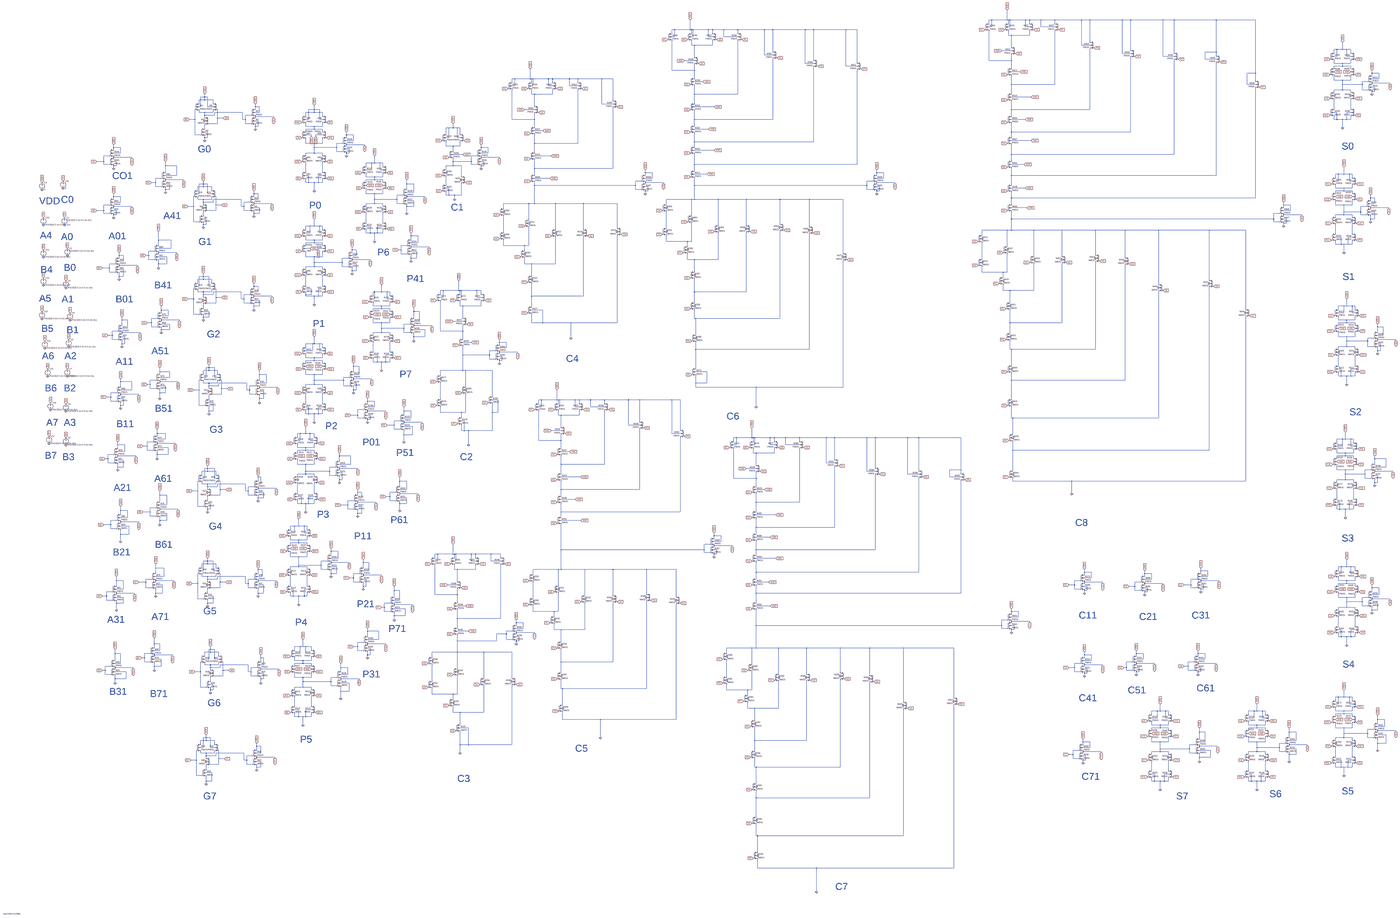
[diagram p0: schematic 8_BIT.asc, whole sheet]
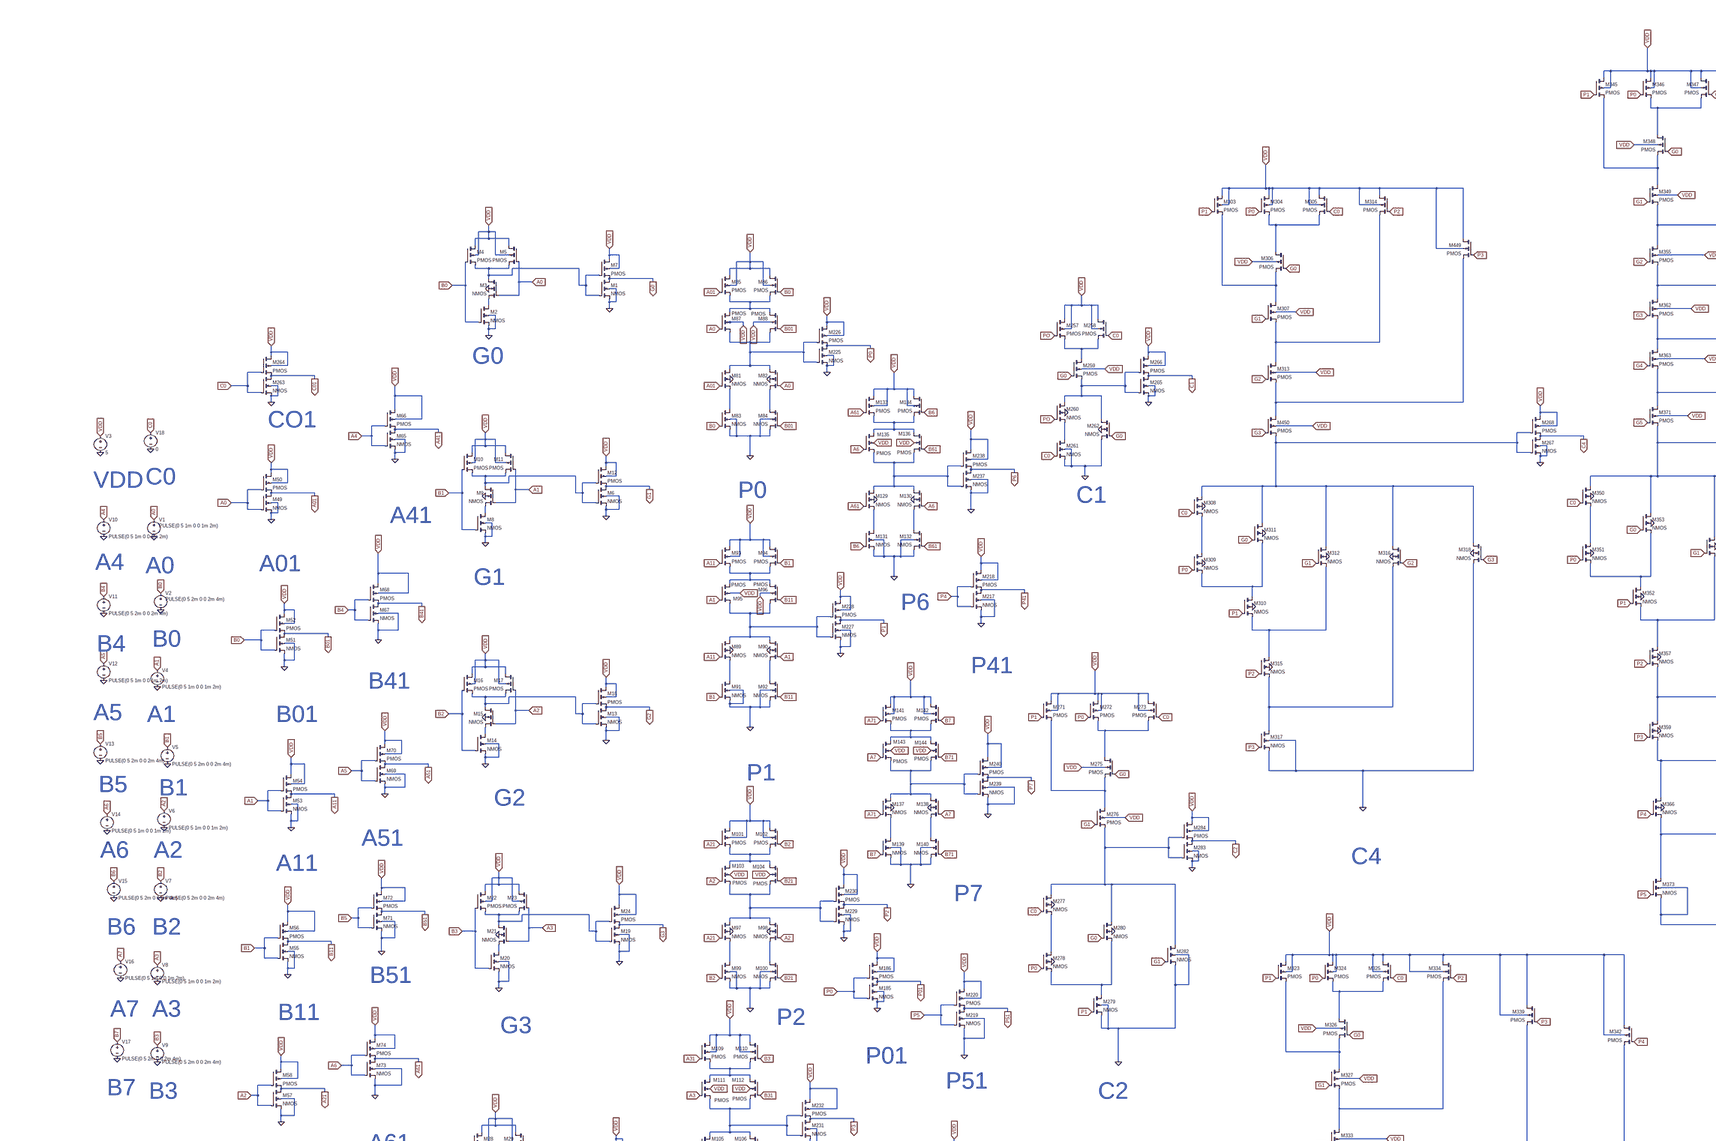
[diagram p1: schematic 8_BIT.asc, part, row 1 of 2, column 1 of 2]
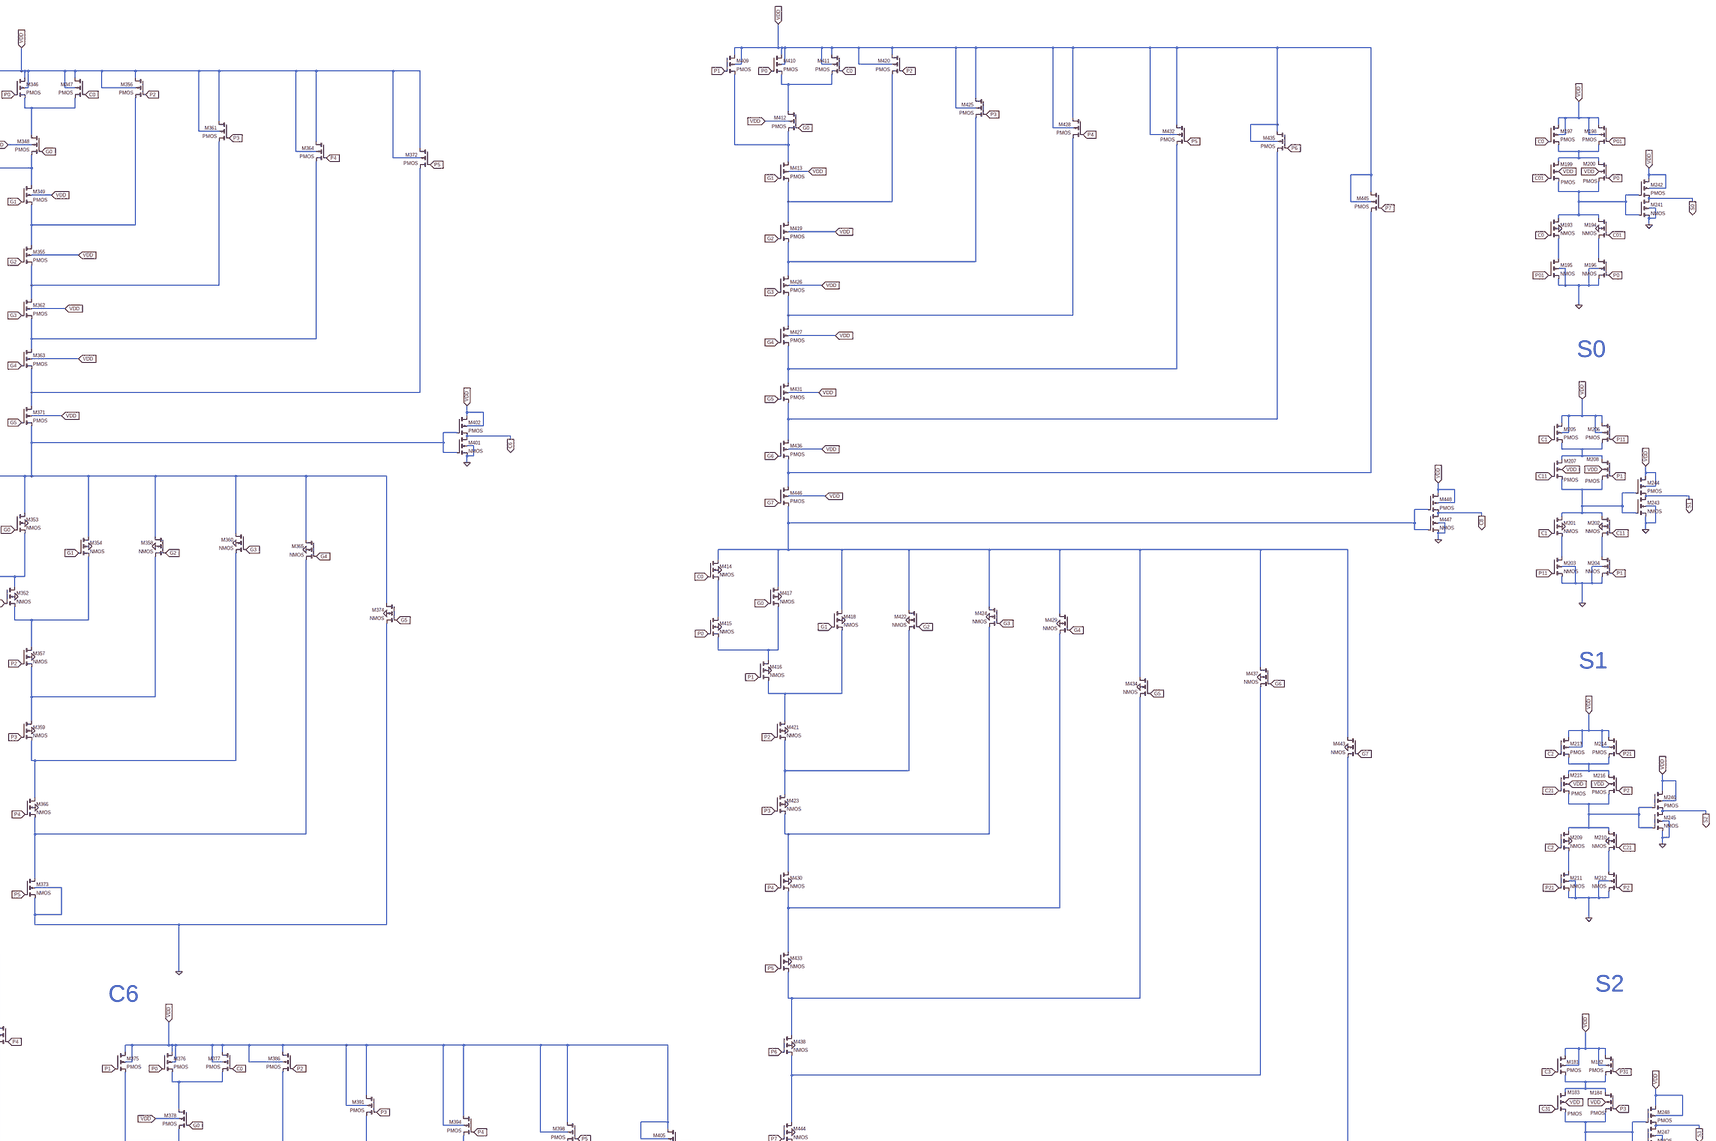
[diagram p2: schematic 8_BIT.asc, part, row 1 of 2, column 2 of 2]
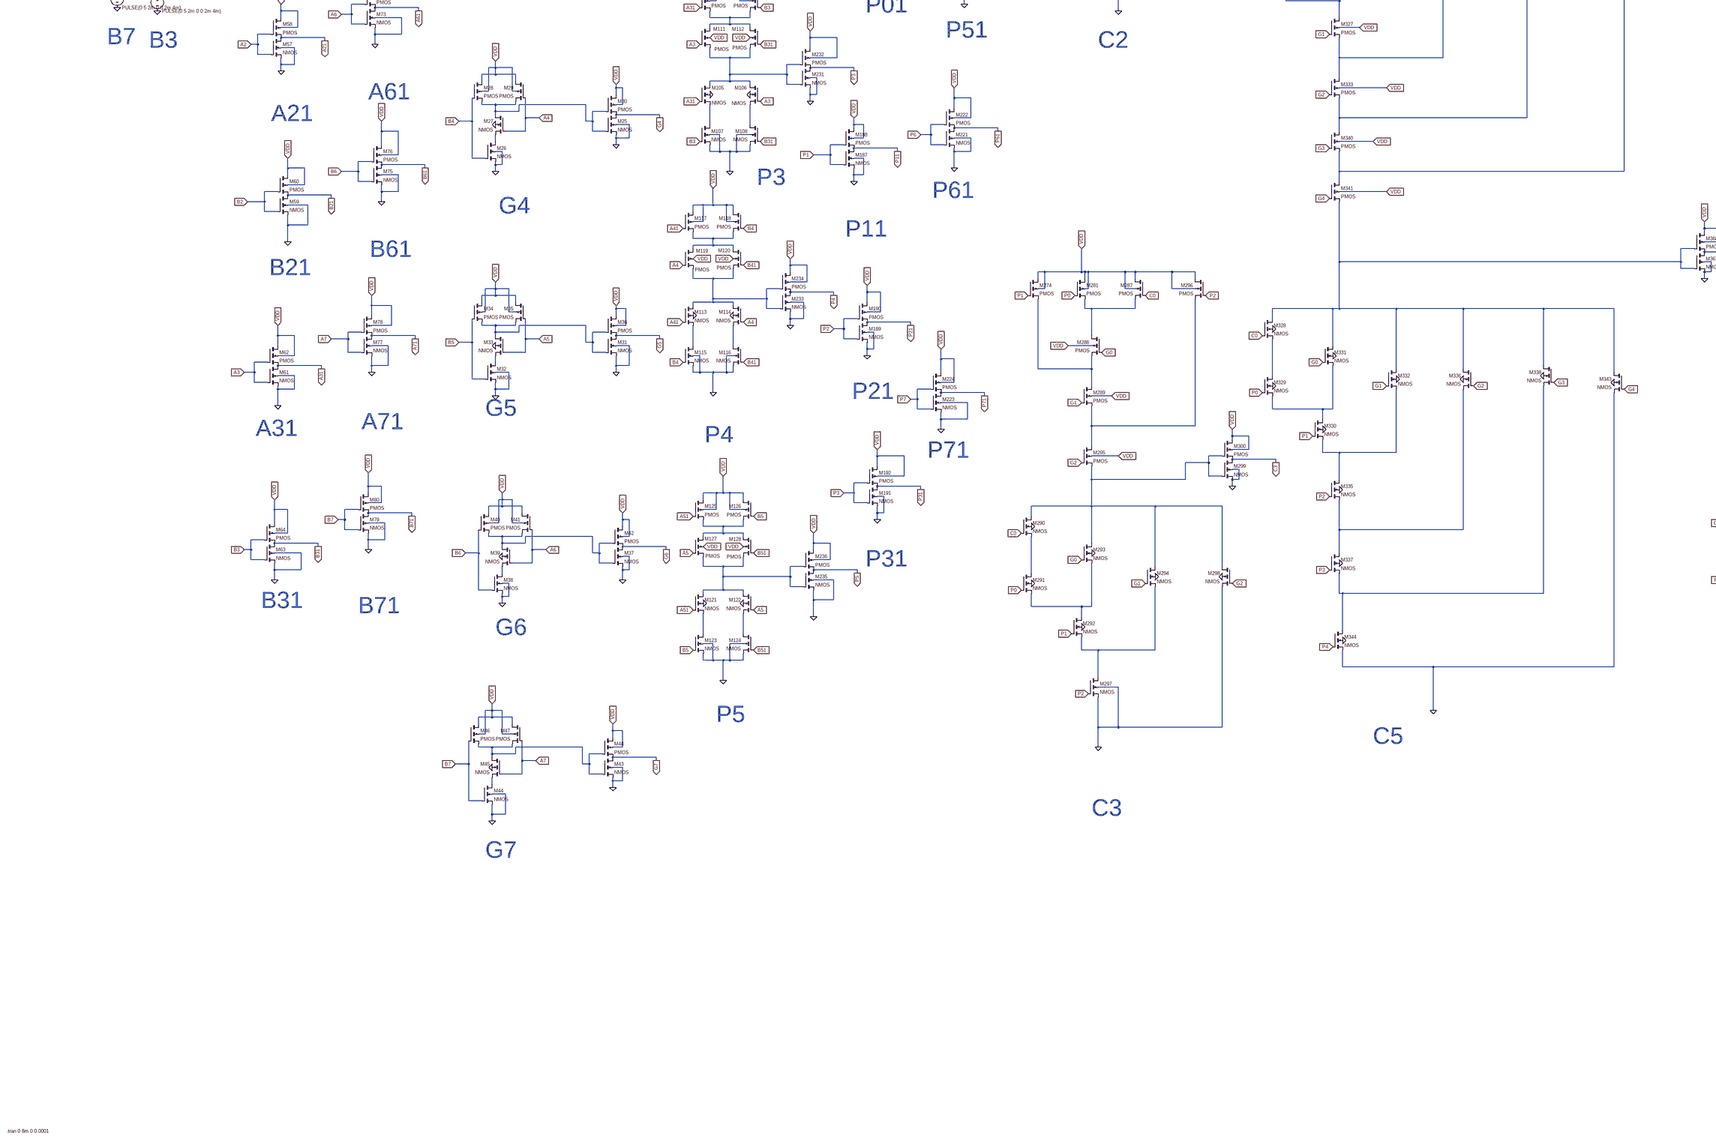
[diagram p3: schematic 8_BIT.asc, part, row 2 of 2, column 1 of 2]
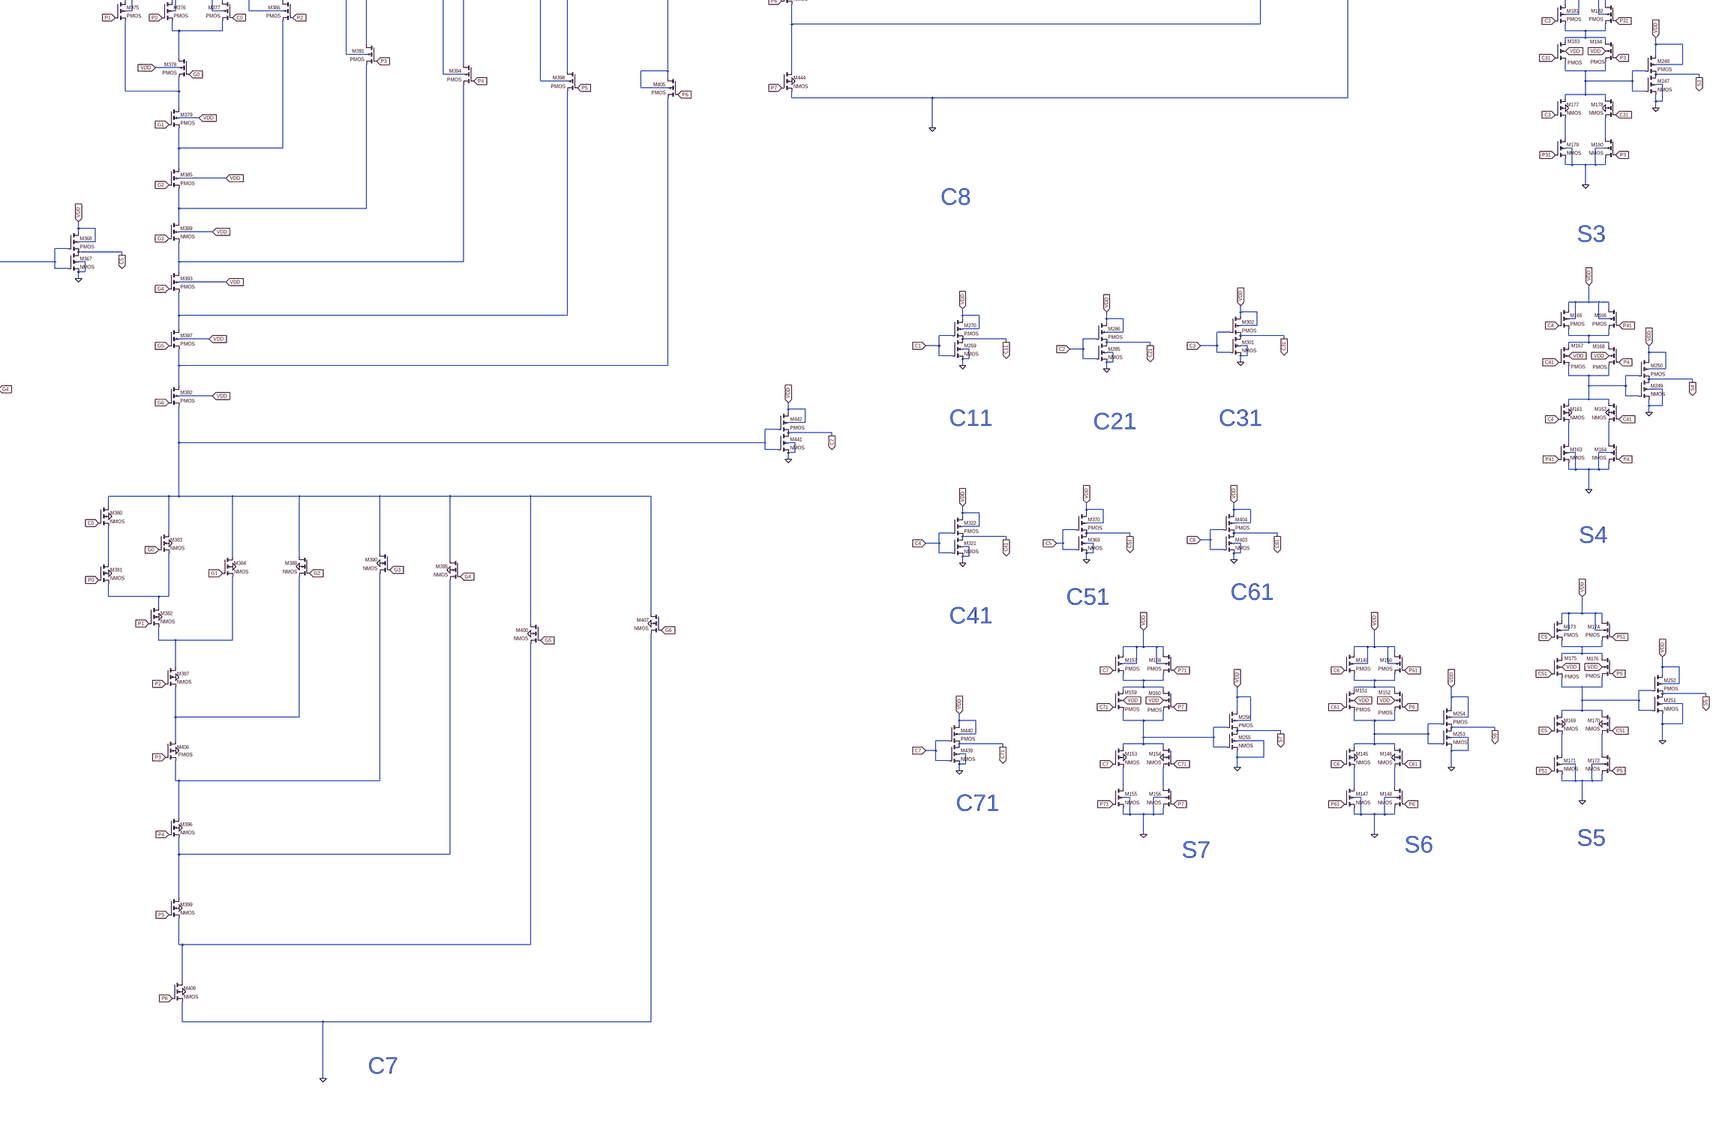
[diagram p4: schematic 8_BIT.asc, part, row 2 of 2, column 2 of 2]
* 8_BIT.asc
M1 G0 N013 0 0 NMOS
M2 N017 B0 0 0 NMOS
M3 N013 A0 N017 0 NMOS
M4 VDD B0 N013 VDD PMOS
M5 VDD A0 N013 VDD PMOS
M7 VDD N013 G0 VDD PMOS
V1 A0 0 PULSE(0 5 1m 0 0 1m 2m)
V2 B0 0 PULSE(0 5 2m 0 0 2m 4m)
V3 VDD 0 5
V4 A1 0 PULSE(0 5 1m 0 0 1m 2m)
V5 B1 0 PULSE(0 5 2m 0 0 2m 4m)
V6 A2 0 PULSE(0 5 1m 0 0 1m 2m)
V7 B2 0 PULSE(0 5 2m 0 0 2m 4m)
V8 A3 0 PULSE(0 5 1m 0 0 1m 2m)
V9 B3 0 PULSE(0 5 2m 0 0 2m 4m)
V10 A4 0 PULSE(0 5 1m 0 0 1m 2m)
V11 B4 0 PULSE(0 5 2m 0 0 2m 4m)
V12 A5 0 PULSE(0 5 1m 0 0 1m 2m)
V13 B5 0 PULSE(0 5 2m 0 0 2m 4m)
V14 A6 0 PULSE(0 5 1m 0 0 1m 2m)
V15 B6 0 PULSE(0 5 2m 0 0 2m 4m)
V16 A7 0 PULSE(0 5 1m 0 0 1m 2m)
V17 B7 0 PULSE(0 5 2m 0 0 2m 4m)
M6 G1 N037 0 0 NMOS
M8 N040 B1 0 0 NMOS
M9 N037 A1 N040 0 NMOS
M10 VDD B1 N037 VDD PMOS
M11 VDD A1 N037 VDD PMOS
M12 VDD N037 G1 VDD PMOS
M13 G2 N058 0 0 NMOS
M14 N063 B2 0 0 NMOS
M15 N058 A2 N063 0 NMOS
M16 VDD B2 N058 VDD PMOS
M17 VDD A2 N058 VDD PMOS
M18 VDD N058 G2 VDD PMOS
M19 G3 N080 0 0 NMOS
M20 N081 B3 0 0 NMOS
M21 N080 A3 N081 0 NMOS
M22 VDD B3 N080 VDD PMOS
M23 VDD A3 N080 VDD PMOS
M24 VDD N080 G3 VDD PMOS
M25 G4 N097 0 0 NMOS
M26 N103 B4 0 0 NMOS
M27 N097 A4 N103 0 NMOS
M28 VDD B4 N097 VDD PMOS
M29 VDD A4 N097 VDD PMOS
M30 VDD N097 G4 VDD PMOS
M31 G5 N113 0 0 NMOS
M32 N117 B5 0 0 NMOS
M33 N113 A5 N117 0 NMOS
M34 VDD B5 N113 VDD PMOS
M35 VDD A5 N113 VDD PMOS
M36 VDD N113 G5 VDD PMOS
M37 G6 N131 0 0 NMOS
M38 N134 B6 0 0 NMOS
M39 N131 A6 N134 0 NMOS
M40 VDD B6 N131 VDD PMOS
M41 VDD A6 N131 VDD PMOS
M42 VDD N131 G6 VDD PMOS
M43 G7 N150 0 0 NMOS
M44 N154 B7 0 0 NMOS
M45 N150 A7 N154 0 NMOS
M46 VDD B7 N150 VDD PMOS
M47 VDD A7 N150 VDD PMOS
M48 VDD N150 G7 VDD PMOS
M49 A01 A0 0 0 NMOS
M50 VDD A0 A01 VDD PMOS
M51 B01 B0 0 0 NMOS
M52 VDD B0 B01 VDD PMOS
M53 A11 A1 0 0 NMOS
M54 VDD A1 A11 VDD PMOS
M55 B11 B1 0 0 NMOS
M56 VDD B1 B11 VDD PMOS
M57 A21 A2 0 0 NMOS
M58 VDD A2 A21 VDD PMOS
M59 B21 B2 0 0 NMOS
M60 VDD B2 B21 VDD PMOS
M61 A31 A3 0 0 NMOS
M62 VDD A3 A31 VDD PMOS
M63 B31 B3 0 0 NMOS
M64 VDD B3 B31 VDD PMOS
M65 A41 A4 0 0 NMOS
M66 VDD A4 A41 VDD PMOS
M67 B41 B4 0 0 NMOS
M68 VDD B4 B41 VDD PMOS
M69 A51 A5 0 0 NMOS
M70 VDD A5 A51 VDD PMOS
M71 B51 B5 0 0 NMOS
M72 VDD B5 B51 VDD PMOS
M73 A61 A6 0 0 NMOS
M74 VDD A6 A61 VDD PMOS
M75 B61 B6 0 0 NMOS
M76 VDD B6 B61 VDD PMOS
M77 A71 A7 0 0 NMOS
M78 VDD A7 A71 VDD PMOS
M79 B71 B7 0 0 NMOS
M80 VDD B7 B71 VDD PMOS
M81 N020 A01 N027 0 NMOS
M82 N020 A0 N028 0 NMOS
M83 N027 B0 0 0 NMOS
M84 N028 B01 0 0 NMOS
M85 VDD A01 N016 VDD PMOS
M86 VDD B0 N016 VDD PMOS
M87 N016 A0 N020 VDD PMOS
M88 N016 B01 N020 VDD PMOS
M89 N050 A11 N055 0 NMOS
M90 N050 A1 N056 0 NMOS
M91 N055 B1 0 0 NMOS
M92 N056 B11 0 0 NMOS
M93 VDD A11 N047 VDD PMOS
M94 VDD B1 N047 VDD PMOS
M95 N047 A1 N050 VDD PMOS
M96 N047 B11 N050 VDD PMOS
M97 N078 A21 N083 0 NMOS
M98 N078 A2 N084 0 NMOS
M99 N083 B2 0 0 NMOS
M100 N084 B21 0 0 NMOS
M101 VDD A21 N075 VDD PMOS
M102 VDD B2 N075 VDD PMOS
M103 N075 A2 N078 VDD PMOS
M104 N075 B21 N078 VDD PMOS
M105 N093 A31 N099 0 NMOS
M106 N093 A3 N100 0 NMOS
M107 N099 B3 0 0 NMOS
M108 N100 B31 0 0 NMOS
M109 VDD A31 N089 VDD PMOS
M110 VDD B3 N089 VDD PMOS
M111 N089 A3 N093 VDD PMOS
M112 N089 B31 N093 VDD PMOS
M113 N110 A41 N115 0 NMOS
M114 N110 A4 N116 0 NMOS
M115 N115 B4 0 0 NMOS
M116 N116 B41 0 0 NMOS
M117 VDD A41 N107 VDD PMOS
M118 VDD B4 N107 VDD PMOS
M119 N107 A4 N110 VDD PMOS
M120 N107 B41 N110 VDD PMOS
M121 N133 A51 N139 0 NMOS
M122 N133 A5 N140 0 NMOS
M123 N139 B5 0 0 NMOS
M124 N140 B51 0 0 NMOS
M125 VDD A51 N129 VDD PMOS
M126 VDD B5 N129 VDD PMOS
M127 N129 A5 N133 VDD PMOS
M128 N129 B51 N133 VDD PMOS
M129 N035 A61 N041 0 NMOS
M130 N035 A6 N042 0 NMOS
M131 N041 B6 0 0 NMOS
M132 N042 B61 0 0 NMOS
M133 VDD A61 N030 VDD PMOS
M134 VDD B6 N030 VDD PMOS
M135 N030 A6 N035 VDD PMOS
M136 N030 B61 N035 VDD PMOS
M137 N066 A71 N072 0 NMOS
M138 N066 A7 N073 0 NMOS
M139 N072 B7 0 0 NMOS
M140 N073 B71 0 0 NMOS
M141 VDD A71 N061 VDD PMOS
M142 VDD B7 N061 VDD PMOS
M143 N061 A7 N066 VDD PMOS
M144 N061 B71 N066 VDD PMOS
M193 N006 C0 N010 0 NMOS
M194 N006 C01 N011 0 NMOS
M195 N010 P01 0 0 NMOS
M196 N011 P0 0 0 NMOS
M197 VDD C0 N004 VDD PMOS
M198 VDD P01 N004 VDD PMOS
M199 N004 C01 N006 VDD PMOS
M200 N004 P0 N006 VDD PMOS
M201 N038 C1 N045 0 NMOS
M202 N038 C11 N046 0 NMOS
M203 N045 P11 0 0 NMOS
M204 N046 P1 0 0 NMOS
M205 VDD C1 N034 VDD PMOS
M206 VDD P11 N034 VDD PMOS
M207 N034 C11 N038 VDD PMOS
M208 N034 P1 N038 VDD PMOS
M209 N069 C2 N076 0 NMOS
M210 N069 C21 N077 0 NMOS
M211 N076 P21 0 0 NMOS
M212 N077 P2 0 0 NMOS
M213 VDD C2 N065 VDD PMOS
M214 VDD P21 N065 VDD PMOS
M215 N065 C21 N069 VDD PMOS
M216 N065 P2 N069 VDD PMOS
M145 N149 C6 N157 0 NMOS
M146 N149 C61 N158 0 NMOS
M147 N157 P61 0 0 NMOS
M148 N158 P6 0 0 NMOS
M149 VDD C6 N145 VDD PMOS
M150 VDD P61 N145 VDD PMOS
M151 N145 C61 N149 VDD PMOS
M152 N145 P6 N149 VDD PMOS
M153 N148 C7 N155 0 NMOS
M154 N148 C71 N156 0 NMOS
M155 N155 P71 0 0 NMOS
M156 N156 P7 0 0 NMOS
M157 VDD C7 N144 VDD PMOS
M158 VDD P71 N144 VDD PMOS
M159 N144 C71 N148 VDD PMOS
M160 N144 P7 N148 VDD PMOS
M161 N121 C4 N125 0 NMOS
M162 N121 C41 N126 0 NMOS
M163 N125 P41 0 0 NMOS
M164 N126 P4 0 0 NMOS
M165 VDD C4 N114 VDD PMOS
M166 VDD P41 N114 VDD PMOS
M167 N114 C41 N121 VDD PMOS
M168 N114 P4 N121 VDD PMOS
M169 N146 C5 N151 0 NMOS
M170 N146 C51 N152 0 NMOS
M171 N151 P51 0 0 NMOS
M172 N152 P5 0 0 NMOS
M173 VDD C5 N142 VDD PMOS
M174 VDD P51 N142 VDD PMOS
M175 N142 C51 N146 VDD PMOS
M176 N142 P5 N146 VDD PMOS
M177 N095 C3 N101 0 NMOS
M178 N095 C31 N102 0 NMOS
M179 N101 P31 0 0 NMOS
M180 N102 P3 0 0 NMOS
M181 VDD C3 N092 VDD PMOS
M182 VDD P31 N092 VDD PMOS
M183 N092 C31 N095 VDD PMOS
M184 N092 P3 N095 VDD PMOS
M185 P01 P0 0 0 NMOS
M186 VDD P0 P01 VDD PMOS
M187 P11 P1 0 0 NMOS
M188 VDD P1 P11 VDD PMOS
M189 P21 P2 0 0 NMOS
M190 VDD P2 P21 VDD PMOS
M191 P31 P3 0 0 NMOS
M192 VDD P3 P31 VDD PMOS
M217 P41 P4 0 0 NMOS
M218 VDD P4 P41 VDD PMOS
M219 P51 P5 0 0 NMOS
M220 VDD P5 P51 VDD PMOS
M221 P61 P6 0 0 NMOS
M222 VDD P6 P61 VDD PMOS
M223 P71 P7 0 0 NMOS
M224 VDD P7 P71 VDD PMOS
M225 P0 N020 0 0 NMOS
M226 VDD N020 P0 VDD PMOS
M227 P1 N050 0 0 NMOS
M228 VDD N050 P1 VDD PMOS
M229 P2 N078 0 0 NMOS
M230 VDD N078 P2 VDD PMOS
M231 P3 N093 0 0 NMOS
M232 VDD N093 P3 VDD PMOS
M233 P4 N110 0 0 NMOS
M234 VDD N110 P4 VDD PMOS
M235 P5 N133 0 0 NMOS
M236 VDD N133 P5 VDD PMOS
M237 P6 N035 0 0 NMOS
M238 VDD N035 P6 VDD PMOS
M239 P7 N066 0 0 NMOS
M240 VDD N066 P7 VDD PMOS
M241 S0 N006 0 0 NMOS
M242 VDD N006 S0 VDD PMOS
M243 S1 N038 0 0 NMOS
M244 VDD N038 S1 VDD PMOS
M245 S2 N069 0 0 NMOS
M246 VDD N069 S2 VDD PMOS
M247 S3 N095 0 0 NMOS
M248 VDD N095 S3 VDD PMOS
M249 S4 N121 0 0 NMOS
M250 VDD N121 S4 VDD PMOS
M251 S5 N146 0 0 NMOS
M252 VDD N146 S5 VDD PMOS
M253 S6 N149 0 0 NMOS
M254 VDD N149 S6 VDD PMOS
M255 S7 N148 0 0 NMOS
M256 VDD N148 S7 VDD PMOS
M257 VDD PO N022 VDD PMOS
M258 VDD C0 N022 VDD PMOS
M259 N022 G0 N024 VDD PMOS
M260 N024 PO N033 0 NMOS
M261 N033 C0 0 0 NMOS
M262 N024 G0 0 0 NMOS
V18 C0 0 0
M263 C01 C0 0 0 NMOS
M264 VDD C0 C01 VDD PMOS
M265 C1 N024 0 0 NMOS
M266 VDD N024 C1 VDD PMOS
M267 C4 N031 0 0 NMOS
M268 VDD N031 C4 VDD PMOS
M269 C11 C1 0 0 NMOS
M270 VDD C1 C11 VDD PMOS
M271 VDD P1 N068 VDD PMOS
M272 VDD P0 N062 VDD PMOS
M273 VDD C0 N062 VDD PMOS
M275 N062 G0 N068 VDD PMOS
M276 N068 G1 N074 VDD PMOS
M277 N074 C0 N082 0 NMOS
M278 N082 P0 N085 0 NMOS
M279 N085 P1 0 0 NMOS
M280 N074 G0 N085 0 NMOS
M282 N074 G1 0 0 NMOS
M283 C2 N074 0 0 NMOS
M284 VDD N074 C2 VDD PMOS
M285 C21 C2 0 0 NMOS
M286 VDD C2 C21 VDD PMOS
M274 VDD P1 N119 VDD PMOS
M281 VDD P0 N111 VDD PMOS
M287 VDD C0 N111 VDD PMOS
M288 N111 G0 N119 VDD PMOS
M289 N119 G1 N123 VDD PMOS
M290 N128 C0 N135 0 NMOS
M291 N135 P0 N138 0 NMOS
M292 N138 P1 N143 0 NMOS
M293 N128 G0 N138 0 NMOS
M294 N128 G1 N143 0 NMOS
M295 N123 G2 N128 VDD PMOS
M296 VDD P2 N123 VDD PMOS
M297 N143 P2 0 0 NMOS
M298 N128 G2 0 0 NMOS
M299 C3 N128 0 0 NMOS
M300 VDD N128 C3 VDD PMOS
M301 C31 C3 0 0 NMOS
M302 VDD C3 C31 VDD PMOS
M303 VDD P1 N014 VDD PMOS
M304 VDD P0 N008 VDD PMOS
M305 VDD C0 N008 VDD PMOS
M306 N008 G0 N014 VDD PMOS
M307 N014 G1 N021 VDD PMOS
M308 N031 C0 N044 0 NMOS
M309 N044 P0 N049 0 NMOS
M310 N049 P1 N053 0 NMOS
M311 N031 G0 N049 0 NMOS
M312 N031 G1 N053 0 NMOS
M313 N021 G2 N026 VDD PMOS
M314 VDD P2 N021 VDD PMOS
M315 N053 P2 N060 0 NMOS
M316 N031 G2 N060 0 NMOS
M321 C41 C4 0 0 NMOS
M322 VDD C4 C41 VDD PMOS
M323 VDD P1 N088 VDD PMOS
M324 VDD P0 N086 VDD PMOS
M325 VDD C0 N086 VDD PMOS
M326 N086 G0 N088 VDD PMOS
M327 N088 G1 N094 VDD PMOS
M328 N108 C0 N120 0 NMOS
M329 N120 P0 N122 0 NMOS
M330 N122 P1 N127 0 NMOS
M331 N108 G0 N122 0 NMOS
M332 N108 G1 N127 0 NMOS
M333 N094 G2 N098 VDD PMOS
M334 VDD P2 N094 VDD PMOS
M335 N127 P2 N130 0 NMOS
M336 N108 G2 N130 0 NMOS
M337 N130 P3 N136 0 NMOS
M338 N108 G3 N136 0 NMOS
M339 VDD P3 N098 VDD PMOS
M340 N098 G3 N105 VDD PMOS
M341 N105 G4 N108 VDD PMOS
M342 VDD P4 N105 VDD PMOS
M343 N108 G4 0 0 NMOS
M344 N136 P4 0 0 NMOS
M367 C5 N108 0 0 NMOS
M368 VDD N108 C5 VDD PMOS
M369 C51 C5 0 0 NMOS
M370 VDD C5 C51 VDD PMOS
M345 VDD P1 N005 VDD PMOS
M346 VDD P0 N002 VDD PMOS
M347 VDD C0 N002 VDD PMOS
M348 N002 G0 N005 VDD PMOS
M349 N005 G1 N009 VDD PMOS
M350 N032 C0 N043 0 NMOS
M351 N043 P0 N048 0 NMOS
M352 N048 P1 N052 0 NMOS
M353 N032 G0 N048 0 NMOS
M354 N032 G1 N052 0 NMOS
M355 N009 G2 N015 VDD PMOS
M356 VDD P2 N009 VDD PMOS
M357 N052 P2 N059 0 NMOS
M358 N032 G2 N059 0 NMOS
M359 N059 P3 N064 0 NMOS
M360 N032 G3 N064 0 NMOS
M361 VDD P3 N015 VDD PMOS
M362 N015 G3 N019 VDD PMOS
M363 N019 G4 N025 VDD PMOS
M364 VDD P4 N019 VDD PMOS
M365 N032 G4 N070 0 NMOS
M366 N064 P4 N070 0 NMOS
M371 N025 G5 N032 VDD PMOS
M372 VDD P5 N025 VDD PMOS
M373 N070 P5 0 0 NMOS
M374 N032 G5 0 0 NMOS
M375 VDD P1 N096 VDD PMOS
M376 VDD P0 N091 VDD PMOS
M377 VDD C0 N091 VDD PMOS
M378 N091 G0 N096 VDD PMOS
M379 N096 G1 N104 VDD PMOS
M380 N124 C0 N132 0 NMOS
M381 N132 P0 N137 0 NMOS
M382 N137 P1 N141 0 NMOS
M383 N124 G0 N137 0 NMOS
M384 N124 G1 N141 0 NMOS
M385 N104 G2 N106 VDD PMOS
M386 VDD P2 N104 VDD PMOS
M387 N141 P2 N147 0 NMOS
M388 N124 G2 N147 0 NMOS
M389 N106 G3 N109 VDD NMOS
M390 N124 G3 N153 0 NMOS
M391 VDD P3 N106 VDD PMOS
M392 N118 G6 N124 VDD PMOS
M393 N109 G4 N112 VDD PMOS
M394 VDD P4 N109 VDD PMOS
M395 N124 G4 N159 0 NMOS
M396 N153 P4 N159 0 NMOS
M397 N112 G5 N118 VDD PMOS
M398 VDD P5 N112 VDD PMOS
M399 N159 P5 N160 0 NMOS
M400 N124 G5 N160 0 NMOS
M401 C6 N032 0 0 NMOS
M402 VDD N032 C6 VDD PMOS
M403 C61 C6 0 0 NMOS
M404 VDD C6 C61 VDD PMOS
M405 VDD P6 N118 VDD PMOS
M406 N147 P3 N153 0 PMOS
M407 N124 G6 0 0 NMOS
M408 N160 P6 0 0 NMOS
M409 VDD P1 N003 VDD PMOS
M410 VDD P0 N001 VDD PMOS
M411 VDD C0 N001 VDD PMOS
M412 N001 G0 N003 VDD PMOS
M413 N003 G1 N007 VDD PMOS
M414 N039 C0 N051 0 NMOS
M415 N051 P0 N054 0 NMOS
M416 N054 P1 N057 0 NMOS
M417 N039 G0 N054 0 NMOS
M418 N039 G1 N057 0 NMOS
M419 N007 G2 N012 VDD PMOS
M420 VDD P2 N007 VDD PMOS
M421 N057 P2 N067 0 NMOS
M422 N039 G2 N067 0 NMOS
M423 N067 P3 N071 0 NMOS
M424 N039 G3 N071 0 NMOS
M425 VDD P3 N012 VDD PMOS
M426 N012 G3 N018 VDD PMOS
M427 N018 G4 N023 VDD PMOS
M428 VDD P4 N018 VDD PMOS
M429 N039 G4 N079 0 NMOS
M430 N071 P4 N079 0 NMOS
M431 N023 G5 N029 VDD PMOS
M432 VDD P5 N023 VDD PMOS
M433 N079 P5 N087 0 NMOS
M434 N039 G5 N087 0 NMOS
M435 VDD P6 N029 VDD PMOS
M436 N029 G6 N036 VDD PMOS
M437 N039 G6 N090 0 NMOS
M438 N087 P6 N090 0 NMOS
M439 C71 C7 0 0 NMOS
M440 VDD C7 C71 VDD PMOS
M441 C7 N124 0 0 NMOS
M442 VDD N124 C7 VDD PMOS
M443 N039 G7 0 0 NMOS
M444 N090 P7 0 0 NMOS
M445 VDD P7 N036 VDD PMOS
M446 N036 G7 N039 VDD PMOS
M447 C8 N039 0 0 NMOS
M448 VDD N039 C8 VDD PMOS
M449 VDD P3 N026 VDD PMOS
M450 N026 G3 N031 VDD PMOS
M317 N060 P3 0 0 NMOS
M318 N031 G3 0 0 NMOS
.model NMOS NMOS
.model PMOS PMOS
.lib standard.mos
* G0
* G1
* G2
* G3
* G4
* G5
* G6
* G7
* A0
* B0
* A1
* B1
* A2
* A3
* B2
* B3
* A4
* B4
* A5
* A6
* B5
* B6
* A7
* B7
* A01
* B01
* A11
* B11
* A21
* B21
* A31
* B31
* A41
* B41
* A51
* B51
* A61
* B61
* A71
* B71
* P0
* P1
* P2
* P3
* P4
* P5
* P6
* P7
* S0
* S1
* S2
* S3
* S4
* S5
* S6
* S7
* P01
* P11
* P21
* P31
* P41
* P51
* P61
* P71
* C1
* C0
* VDD
* CO1
* C11
* C2
* C21
* C3
* C31
* C4
* C41
* C5
* C6
* C51
* C7
* C61
* C8
* C71
.tran 0 8m 0 0.0001
.backanno
.end